# Altium schematic sheet regulator_2025-05-19.schdoc
size 263 x 92 mm
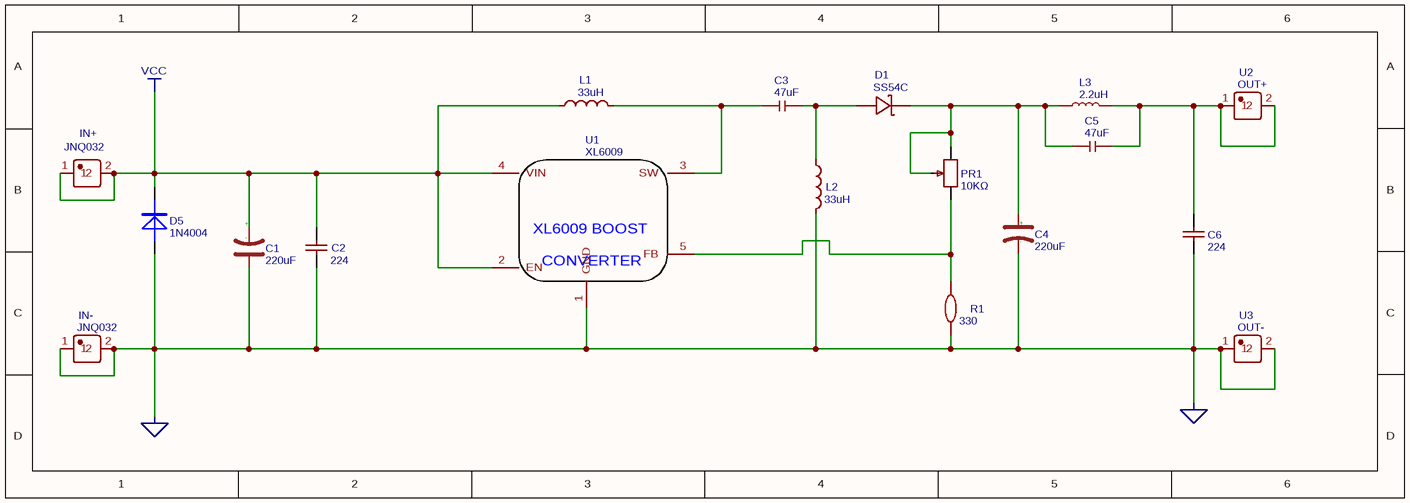
[diagram p0: regulator_2025-05-19.schdoc]

## Parts
C1  220uF  [ELECTRO-SMD-C-6MM]
C2  224  [C0805]
C3  47uF  [C1210]
C4  220uF  [ELECTRO-SMD-C-6MM]
C5  47uF  [C1210]
C6  224  [C0805]
D1  SS54C  [SMC_L7.5-W5.8-LS8.3-RD]
D5  1N4004  [SMA-DO214AC]
IN+  JNQ032  [CONN-TH_JNQ032]
IN-  JNQ032  [CONN-TH_JNQ032]
L1  33uH  [IND-SMD_L12.3-W12.3]
L2  33uH  [IND-SMD_L12.3-W12.3]
L3  2.2uH  [INT2-SMD-4.8X4.6X1.0MM]
PR1  10KΩ  [RES-ADJ_3296W]
R1  330  [R0805]
U1  XL6009  [TO-263-5]
U2  OUT+  [CONN-TH_JNQ032]
U3  OUT-  [CONN-TH_JNQ032]

## Nets
GND: C1.+ C2.1 C4.- C6.1 D5.A IN-.1 IN-.2 L2.2 R1.1 U1.1(GND) U3.1 U3.2
VCC: C1.- C2.2 D5.K IN+.1 IN+.2 L1.1 U1.2(EN) U1.4(VIN)
NetC3_1: C3.1 L1.2 U1.3(SW)
NetC3_2: C3.2 D1.2(A) L2.1
NetC4_+: C4.+ C5.1 D1.1(K) L3.1 PR1.1 PR1.2
NetC5_2: C5.2 C6.2 L3.2 U2.1 U2.2
NetPR1_3: PR1.3 R1.2 U1.5(FB)

## Notes on the sheet
- (in symbol XL6009) XL6009 BOOST / CONVERTER

## Library data of the parts
C1 C4 = 220uF: Manufacturer Part: CS1E221M-CRE77; catid: 20; spicePre: C
C2 C6 = 224: Manufacturer: FH; Manufacturer Part: 0805F224M500NT; nameAlias: Capacitance; Supplier: LCSC; Supplier Part: C41051; JLCPCB Part Class: Extended Part; spicePre: C; spiceSymbolName: 0805F224M500NT_C41051
C3 C5 = 47uF: Manufacturer Part: GRM32ER71A476ME15L; catid: 20; spicePre: C
D1 = SS54C: Manufacturer: LGE(鲁光); Manufacturer Part: SS54; Contributor: LCSC; Supplier: LCSC; Supplier Part: C330398; JLCPCB Part Class: Extended Part; spicePre: D; spiceSymbolName: SS54C
IN+ IN- = JNQ032: Manufacturer: TML(特米勒); Contributor: LCSC; Supplier: LCSC; Supplier Part: C499665; Manufacturer Part: JNQ032; JLCPCB Part Class: Extended Part; spicePre: U; spiceSymbolName: JNQ032
L1 L2 = 33uH: Manufacturer: SHOU HAN(首韩); Manufacturer Part: CYH125-33UH; nameAlias: Inductance; Contributor: lcsc; Supplier: LCSC; Supplier Part: C2879698; JLCPCB Part Class: Extended Part; spicePre: L; spiceSymbolName: CYH125-33UH
L3 = 2.2uH: Manufacturer Part: VLF5010ST-2R2M2R0; catid: 20; spicePre: L
PR1 = 10KΩ: Manufacturer: ReliaPro; Manufacturer Part: 3296W-1-103; Value: 10KΩ; Supplier: LCSC; spicePre: P; Supplier Part: C56237
R1 = 330: Manufacturer: YAGEO(国巨); Manufacturer Part: AC0805JR-07330RL; nameAlias: Resistance (Ohms); Contributor: LCSC; Resistance: 330Ω; Supplier: LCSC; Supplier Part: C229189; JLCPCB Part Class: Extended Part; spicePre: R; spiceSymbolName: AC0805JR-07330RL
U1 = XL6009: Manufacturer: XLSEMI; sourceId: BD9FzR93l; Contributor: GerryChen; Supplier: LCSC; Manufacturer Part: XL6009; spicePre: U; Supplier Part: C15831
U2 = OUT+: Manufacturer: TML(特米勒); Manufacturer Part: JNQ032; Contributor: LCSC; Supplier: LCSC; Supplier Part: C499665; JLCPCB Part Class: Extended Part; spicePre: U; spiceSymbolName: JNQ032
U3 = OUT-: Manufacturer: TML(特米勒); Manufacturer Part: JNQ032; Contributor: LCSC; Supplier: LCSC; Supplier Part: C499665; JLCPCB Part Class: Extended Part; spicePre: U; spiceSymbolName: JNQ032
D5 = 1N4004: Manufacturer Part: ?; spicePre: D